# EAGLE schematic Enclosure 63x58 PBC (EAGLE 9.6.2)
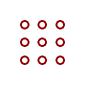
[diagram p0: schematic, sheet 1]

## Parts
U$1  PROTO-20X18-C  [PROTO-20X18-C]

## Library data of the parts
U$1 = digitalconcepts:PROTO-20X18-C: 20 x 18 Prototyping board, with cut-outs, to fit a 63 x 58 enclosure